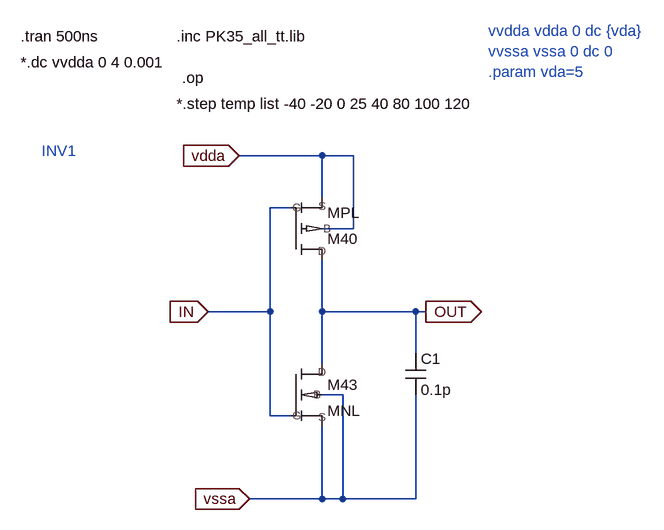
[diagram p0: schematic S_INV1.asc]
S_INV1.asc, the LTspice schematic file:
Version 4
SHEET 1 5948 5172
WIRE 896 -1344 768 -1344
WIRE 944 -1344 896 -1344
WIRE 896 -1280 896 -1344
WIRE 848 -1264 816 -1264
WIRE 944 -1232 944 -1344
WIRE 944 -1232 896 -1232
WIRE 816 -1104 816 -1264
WIRE 816 -1104 720 -1104
WIRE 896 -1104 896 -1184
WIRE 1040 -1104 896 -1104
WIRE 1056 -1104 1040 -1104
WIRE 1040 -1040 1040 -1104
WIRE 896 -1024 896 -1104
WIRE 928 -976 896 -976
WIRE 816 -944 816 -1104
WIRE 848 -944 816 -944
WIRE 896 -816 896 -928
WIRE 896 -816 784 -816
WIRE 928 -816 928 -976
WIRE 928 -816 896 -816
WIRE 1040 -816 1040 -976
WIRE 1040 -816 928 -816
FLAG 768 -1344 vdda
IOPIN 768 -1344 In
FLAG 784 -816 vssa
IOPIN 784 -816 In
FLAG 720 -1104 IN
IOPIN 720 -1104 In
FLAG 1056 -1104 OUT
IOPIN 1056 -1104 Out
SYMBOL MPL 880 -1232 M180
SYMATTR InstName M40
SYMATTR SpiceLine l=0.8u w=6.6u pd=w+l+l ps=pd ad=w*l as=ad m=1
SYMBOL MNL 880 -976 R0
SYMATTR InstName M43
SYMATTR SpiceLine l=0.8u w=3.3u pd=w+l+l ps=pd ad=w*l as=ad m=1
SYMBOL cap 1024 -1040 R0
SYMATTR InstName C1
SYMATTR Value 0.1p
TEXT 1152 -1536 Left 2 ;vvdda vdda 0 dc {vda}\nvvssa vssa 0 dc 0\n.param vda=5
TEXT 432 -1488 Left 2 !*.dc vvdda 0 4 0.001
TEXT 672 -1424 Left 2 !*.step temp list -40 -20 0 25 40 80 100 120
TEXT 680 -1464 Left 2 !.op
TEXT 672 -1528 Left 2 !.inc PK35_all_tt.lib
TEXT 432 -1528 Left 2 !.tran 500ns
TEXT 464 -1352 Left 2 ;INV1

The netlist it stands for:
* S_INV1.asc
XM40 OUT IN vdda vdda MPL l=0.8u w=6.6u pd=w+l+l ps=pd ad=w*l as=ad m=1  ; pins D G S B
XM43 OUT IN vssa vssa MNL l=0.8u w=3.3u pd=w+l+l ps=pd ad=w*l as=ad m=1  ; pins D G S B
C1 OUT vssa 0.1p
* vvdda vdda 0 dc {vda}
* vvssa vssa 0 dc 0
* .param vda=5
*.dc vvdda 0 4 0.001
*.step temp list -40 -20 0 25 40 80 100 120
.op
.inc PK35_all_tt.lib
.tran 500ns
* INV1
.backanno
.end